# EAGLE design TapOnEr_Fules_Erz (EAGLE 7.4.0)
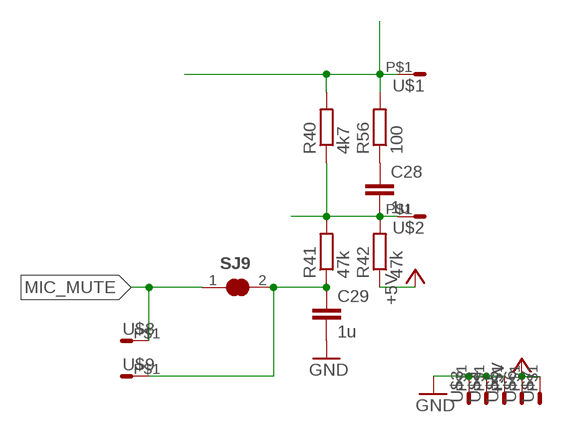
[diagram p0: schematic, sheet 1]

## Parts
C28  1u  C-EUC0805  [C0805]
C29  1u  C-EUC0805  [C0805]
R40  4k7  R-EU_R0805  [R0805]
R41  47k  R-EU_R0805  [R0805]
R42  47k  R-EU_R0805  [R0805]
R56  100  R-EU_R0805  [R0805]
SJ9  SJC  [SJC]
U$1  PADSMD  [PAD_SMD]
U$2  PADSMD  [PAD_SMD]
U$3  PADSMD  [PAD_SMD]
U$4  PADSMD  [PAD_SMD]
U$5  PADSMD  [PAD_SMD]
U$6  PADSMD  [PAD_SMD]
U$7  PADSMD  [PAD_SMD]
U$8  PADSMD  [PAD_SMD]
U$9  PADSMD  [PAD_SMD]

## Nets
+5V: R42.1 U$6.P$1 U$7.P$1
AGND: R40.2 R56.2 U$1.P$1
GND: C29.2 U$3.P$1 U$4.P$1 U$5.P$1
MIC_MUTE: SJ9.1 U$8.P$1
N$11: C28.1 R56.1
N$38: C29.1 R41.1 SJ9.2 U$9.P$1
N$89: C28.2 R40.1 R41.2 R42.2 U$2.P$1

## Library data of the parts
C28 C29 = rcl:C-EU: CAPACITOR, European symbol
R40-R42 R56 = rcl:R-EU_: RESISTOR, European symbol
SJ9 = jumper:SJC
U$1-U$9 = Cf_Csatl:PAD

## Net classes
0 default: width 0.305 mm, clearance 0.305 mm

## Board
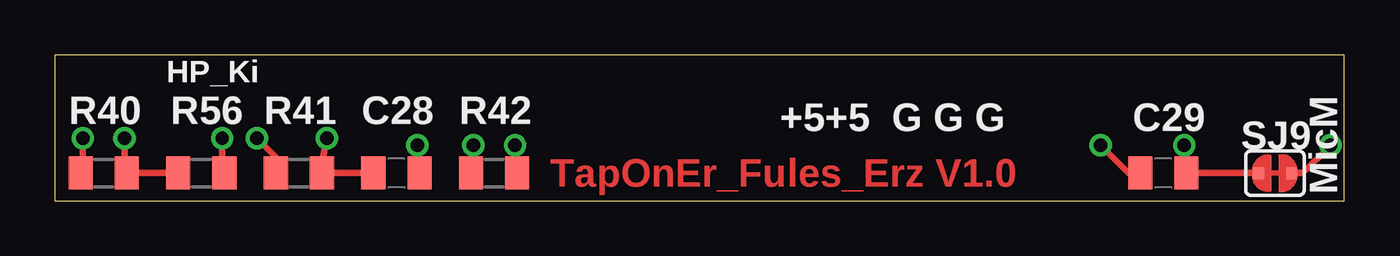
[diagram p1: board, top side]
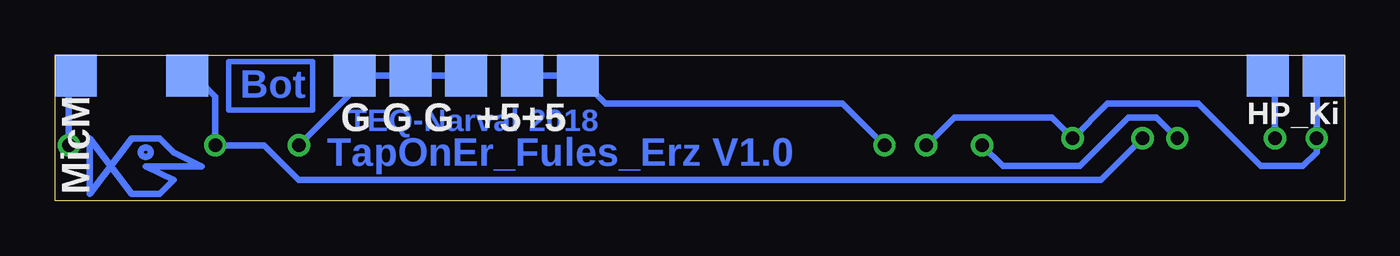
[diagram p2: board, bottom side, seen from below]

Size 58.72 x 6.66 mm. Coordinates in mm from the lower left corner, seen from the top.
Outline: 0,0 58.72,0 58.72,6.66 0,6.66 0,0
Copper layers (1*16): Top 0.035mm / dielectric 1.5mm / Bottom 0.035mm
Design rules "default": minimum track width 10mil, minimum drill 24mil, track to track 8mil, track to pad 8mil, pad to pad 8mil, via to via 8mil, smd to smd 8mil, copper to edge 40mil, drill to drill 8mil, minimum pad ring 10mil, minimum via ring 8mil, stop-mask expansion 4mil, vias tented up to drill 0mil, thermal gap 10mil

### Footprints (pad centres in the part's own frame; a part is rotated, then mirrored left to right if it is on the bottom)
C0805 = smd 1.1 x 1.5: 1 -1.05,0; 2 1.05,0
R0805 = smd 1.1 x 1.5: 1 -1.05,0; 2 1.05,0
SJC = smd 0.508 x 0.508: 1 -0.762,0; 2 0.762,0
PAD_SMD = smd 1.905 x 1.905: P$1 0,0

### Placement (x,y rotation side)
C28  15.56,1.27 180 top
C29  50.48,1.27 180 top
R40  2.22,1.27 0 top
R41  11.11,1.27 0 top
R42  20,1.27 180 top
R56  6.67,1.27 180 top
SJ9  55.56,1.27 180 top
U$1  3.49,5.71 0 bottom
U$2  0.95,5.71 0 bottom
U$3  40.01,5.71 0 bottom
U$4  42.55,5.71 0 bottom
U$5  45.09,5.71 0 bottom
U$6  34.92,5.71 0 bottom
U$7  37.47,5.71 0 bottom
U$8  57.78,5.71 0 bottom
U$9  52.7,5.71 0 bottom

### Tracks (layer width: path | path; a pad name or v marks a point on that pad's centre or on a via)
+5V  (via drill 0.61)
  Top 0.305: R42.1 20.95,1.27 v20.95,2.54
  Bottom 0.305: v20.95,2.54 22.86,4.45 33.66,4.45 U$6.P$1 U$7.P$1
AGND  (via drill 0.61)
  Top 0.305: v3.17,2.86 3.17,1.37 R40.2 R56.2
  Bottom 0.305: v3.17,2.86 3.17,5.4 U$1.P$1
GND  (via drill 0.61)
  Top 0.305: C29.2 48.9,1.27 v47.62,2.54
  Bottom 0.305: U$3.P$1 U$4.P$1 U$5.P$1 45.4,5.71 45.4,4.76 v47.62,2.54
HALACSKA5
  Bottom 0.305: 57.14,2.85 57.14,0.32 55.24,2.85 53.97,2.85 53.33,2.22 52.06,1.58 54.6,1.58 53.33,0.95 53.97,0.32 55.24,0.32 57.14,2.85
MIC_MUTE  (via drill 0.61)
  Top 0.305: v58.1,2.54 56.83,1.27 SJ9.1
  Bottom 0.305: U$8.P$1 58.1,5.4 v58.1,2.54
N$11  (via drill 0.61)
  Top 0.305: R56.1 7.62,1.37 v7.62,2.86 | v16.51,2.54 16.51,1.37 C28.1
  Bottom 0.305: v7.62,2.86 8.57,3.81 9.84,3.81 12.06,1.59 15.56,1.59 v16.51,2.54
N$38  (via drill 0.61)
  Top 0.305: R41.1 10.06,2 v9.21,2.86 | SJ9.2 C29.1 51.44,1.27 v51.44,2.54
  Bottom 0.305: v9.21,2.86 11.11,0.95 47.62,0.95 49.21,2.54 v51.44,2.54 51.44,4.76 52.39,5.71 U$9.P$1
N$89  (via drill 0.61)
  Top 0.305: R40.1 1.27,0.95 v1.27,2.86 | v12.38,2.86 12.06,1.17 R41.2 C28.2 | R42.2 19.05,1.37 v19.05,2.54
  Bottom 0.305: v19.05,2.54 17.78,3.81 13.34,3.81 v12.38,2.86 10.79,4.45 6.67,4.45 3.81,1.59 1.91,1.59 1.27,2.22 v1.27,2.86 1.27,5.4 U$2.P$1
N$217
  Bottom 0.254: 50.82,6.36 50.82,4.14 47.01,4.14 47.01,6.36 50.82,6.36
(copper drawn outside any net)
  shapes: Bottom circle x1

### Text on the board
Top: TapOnEr_Fules_Erz V1.0
Bottom: Bot | TEQ-Narval 2018 | TapOnEr_Fules_Erz V1.0
tNames: HP_Ki | +5+5 G G G | MicM
bNames: HP_Ki | G G G +5+5 | MicM